# Altium schematic sheet 04_POWER_LDO.SchDoc
size A4
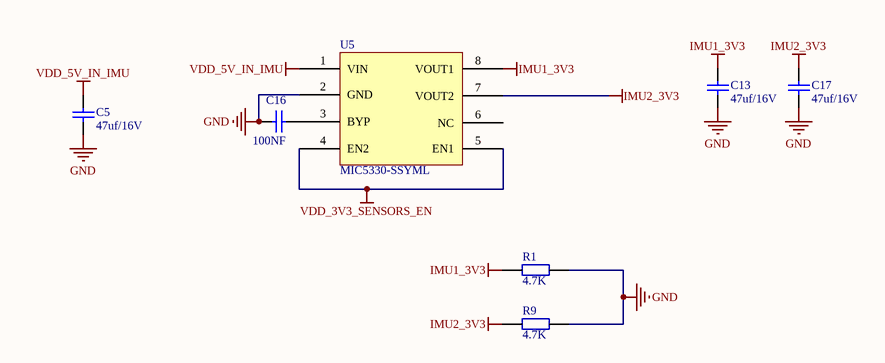
[diagram p0: 04_POWER_LDO.SchDoc]

## Parts
C5  47uf/16V  [0805CAP]
C13  47uf/16V  [0805CAP]
C16  100NF  [0402CAP]
C17  47uf/16V  [0805CAP]
R1  4.7K  [0402R]
R9  4.7K  [0402R]
U5  MIC5330-SSYML  [MIC5530]

## Nets
GND: C5.2 C13.2 C16.2 C17.2 R1.1 R9.1 U5.2(GND)
IMU1_3V3: C13.1 R1.2 U5.8(VOUT1)
IMU2_3V3: C17.1 R9.2 U5.7(VOUT2)
VDD_3V3_SENSORS_EN: U5.4(EN2) U5.5(EN1)
VDD_5V_IN_IMU: C5.1 U5.1(VIN)
NetC16_1: C16.1 U5.3(BYP)

Not connected (* = marked no-connect by the designer): U5 6(NC)

## Library data of the parts
C5 C13 C17 = Cap: Capacitor
C16 = Cap: Value: 100pF; Published: 8-Jun-2000; LatestRevisionDate: 17-Jul-2002; LatestRevisionNote: Re-released for DXP Platform.; PackageReference: RAD-0.3; Publisher: Altium Limited; PackageDescription: Radial Cap, Thru-Hole; 2 Leads; 0.3 in Pin Spacing
R1 R9 = 0402R1K: 0402R1K 1%
U5 = MIC5530